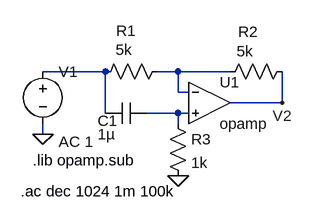
[diagram p0: schematic simu_pasatodo.asc]
simu_pasatodo.asc, the LTspice schematic file:
Version 4
SHEET 1 880 680
WIRE 0 144 -96 144
WIRE 112 144 80 144
WIRE 192 144 112 144
WIRE 112 176 112 144
WIRE 128 176 112 176
WIRE 272 192 272 144
WIRE 272 192 192 192
WIRE 0 208 0 144
WIRE 112 208 64 208
WIRE 128 208 112 208
WIRE 112 224 112 208
WIRE -96 240 -96 224
FLAG 112 304 0
FLAG -96 240 0
FLAG 272 192 V2
SYMBOL OpAmps\\opamp 160 128 R0
SYMATTR InstName U1
SYMBOL res 96 128 R90
WINDOW 0 -31 64 VBottom 2
WINDOW 3 -33 67 VTop 2
SYMATTR InstName R1
SYMATTR Value 5k
SYMBOL res 288 128 R90
WINDOW 0 -30 68 VBottom 2
WINDOW 3 -31 73 VTop 2
SYMATTR InstName R2
SYMATTR Value 5k
SYMBOL res 96 208 R0
SYMATTR InstName R3
SYMATTR Value 1k
SYMBOL cap 64 192 R90
WINDOW 0 43 60 VBottom 2
WINDOW 3 33 62 VTop 2
SYMATTR InstName C1
SYMATTR Value 1µ
SYMBOL voltage -96 128 R0
WINDOW 123 24 124 Left 2
WINDOW 39 0 0 Left 0
SYMATTR InstName V1
SYMATTR Value ""
SYMATTR Value2 AC 1
TEXT -112 280 Left 2 !.lib opamp.sub
TEXT -130 328 Left 2 !.ac dec 1024 1m 100k

The netlist it stands for:
* simu_pasatodo.asc
XU1 N002 N003 V2 opamp Aol=100K GBW=10Meg  ; pins invin noninvin out
R1 N002 N001 5k
R2 V2 N002 5k
R3 N003 0 1k
C1 N003 N001 1µ
V1 N001 0 AC 1
.lib opamp.sub
.ac dec 1024 1m 100k
.backanno
.end